# Altium project UL-SWAP-DAQ-1.PrjPcb (part 2 of 2)

## Sheet ICD4_Interface_Module.SchDoc
size A; SheetNumber: 4; SheetTotal: 16
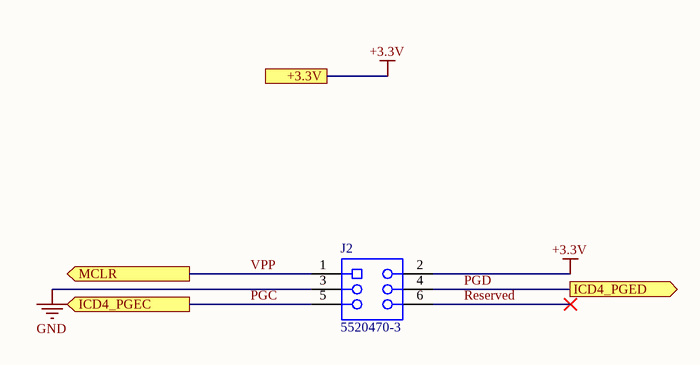
[diagram p10: ICD4_Interface_Module.SchDoc]

### Parts
J2  5520470-3  [TECO-5520470-3_V]

### Ports
+3.3V, ICD4_PGEC (out), ICD4_PGED (out), MCLR (out)

### Nets
+3.3V: J2.2 ; port +3.3V
GND: J2.3
PGC: J2.5 ; port ICD4_PGEC
PGD: J2.4 ; port ICD4_PGED
Reserved: J2.6
VPP: J2.1 ; port MCLR  [project net MCLR]

### Library data of the parts
J2 = CMP-1682-00001-5: Modular Jack, 6 Position, Right Angle, RoHS, Tray; Manufacturer: TE Connectivity; Voltage Rating: 150 V; Current Rating: 1.5 A; Lead Pitch: 2.54 mm; Contact Material: Bronze; RoHSCompliant: true; Contact Finish: Gold; REACH SVHC: Unknown; Height: 16.13 mm; Colour: Black; ComponentLink1Description: Manufacturer URL; PackageDescription: Female Header, Pitch 1.27 mm, 2 x 3 Position, Height 16.13 mm, Tail Length 4.32 mm; ComponentLink2URL: http://www.te.com/commerce/DocumentDelivery/DDEController?Action=srchrtrv&DocNm=5520470&DocType=Customer+Drawing&DocLang=English; ComponentLink2Description: Datasheet; Package Quantity: 176; Pins: 6; Length: 13.34 mm; Packaging: Tray; Contact Plating: Gold; Housing Material: PBT; Max Voltage Rating (AC): 150 V; ComponentLink1URL: http://www.te.com/; Mount: Through Hole; DatasheetVersion: Rev. B1, 03/2011; PackageReference: 5520470-3; Mounting Technology: Through Hole

## Sheet 403mainschematic.SchDoc
size A; SheetNumber: 7; SheetTotal: 15
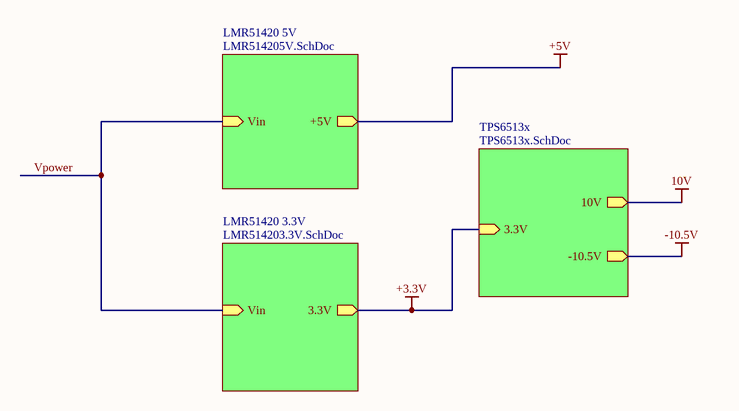
[diagram p11: 403mainschematic.SchDoc]

### Sub-sheets
LMR51420 3.3V = LMR514203.3V.SchDoc (file not in this document): Vin (in), 3.3V (out)
LMR51420 5V = LMR514205V.SchDoc: Vin (in), +5V (out)
TPS6513x = TPS6513x.SchDoc: 3.3V (in), 10V (out), -10.5V (out)

### Nets
10V: sheet TPS6513x/10V
+3.3V: sheet LMR51420 3.3V/3.3V, sheet TPS6513x/3.3V
Vpower: sheet LMR51420 3.3V/Vin, sheet LMR51420 5V/Vin  [project net Vin]

## Sheet LMR514205V.SchDoc
size A; SheetNumber: 8; SheetTotal: 15
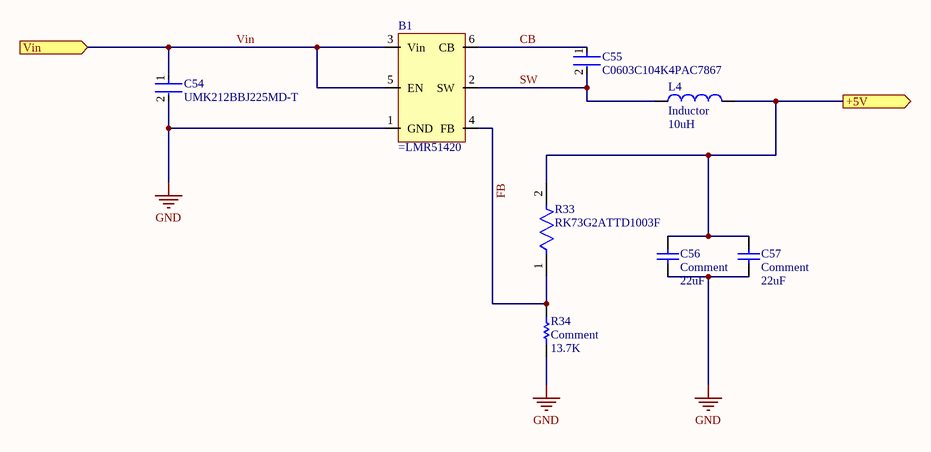
[diagram p12: LMR514205V.SchDoc]

### Parts
(Parts that share a designator on the sheet are numbered #1, #2 ... from top to bottom, then left to right.)
B1#2  (no value)  [PCBComponent_1]
C54  UMK212BBJ225MD-T  [FP-0805-L_2_0_0_2-W_1_25-IPC_A]
C55#1  C0603C104K4PAC7867  [FP-C0603C-CF-MFG]
C56#1  Comment  value 22uF  [Cap22uF_C1206C226M4PAC7800]
C57#1  Comment  value 22uF  [Cap22uF_C1206C226M4PAC7800]
L4  Inductor  value 10uH  [0402-A]
R33  RK73G2ATTD1003F  [FP-RK73G2A-IPC_A]
R34  Comment  value 13.7K  [RMCF0805FT13K7_13.7k]

### Ports
+5V (out), Vin (in)

### Nets
+5V: C56#1.2 C57#1.2 L4.2 R33.2 ; port +5V
GND: B1#2.1(GND) C54.2 C56#1.1 C57#1.1 R34.1
CB: B1#2.6(CB) C55#1.1
FB: B1#2.4(FB) R33.1 R34.2
SW: B1#2.2(SW) C55#1.2 L4.1
Vin: B1#2.3(Vin) B1#2.5(EN) C54.1 ; port Vin

### Library data of the parts
B1#2 = Component_1
C54 = CMP-14477-004278-2: Multilayer Ceramic Capacitor 2.2uF 50V X5R 20% SMD 0803 T/R; Max Operating Temperature: 85°C; Tolerance: 20%; Case Code (Imperial): 0805; Case/Package: 0805; Case Code (Metric): 2012; Capacitance: 2.2uF; Min Operating Temperature: -55°C; Mount: Surface Mount; Voltage Rating: 50V; Packaging: Tape and Reel; RoHS Compliant: Yes
C55#1 = CMP-03020-002384-2: CAP CER 0.1UF 16V X5R 0603; Manufacturer: KEMET; Automotive Grade: Grade 1; Value: 0.10 μF; Material: Ceramic; Temperature Coefficient: 30ppm/°C; Tolerance: 0.1; Manufacturer Part Number: C0603C104K4PAC7867; Automotive: Yes; Octopart: https://octopart.com/c0603c104k4pactu-kemet-12592163; Device Class L2: Capacitors; ComponentLink2URL: https://api.kemet.com/component-edge/download/datasheet/C0603C100J5GACAUTO.pdf; RoHS: TRUE; Height: 0.87mm; Temperature Characteristic: X5R; Voltage Rating: 16 V; Device Class L1: Passive Components; Category: Cap; Digikey Description: CAP CER 0.1UF 16V X5R 0603; Temperature Range High: +125°C; Package: C0603C-CF; Device Class L3: Ceramic Capacitors; Lead Free: Yes; Temperature: -55°C to +125°C; Temperature Range Low: -55°C; Capacitance: 0.10 μF; ComponentLink2Description: Datasheet
C56#1 C57#1 = Cap: Capacitor; Published: 8-Jun-2000; LatestRevisionDate: 17-Jul-2002; LatestRevisionNote: Re-released for DXP Platform.; PackageReference: RAD-0.3; Publisher: Altium Limited; PackageDescription: Radial Cap, Thru-Hole; 2 Leads; 0.3 in Pin Spacing
L4 = Inductor: Code_IEC: 1005; Published: 8-Jun-2000; LatestRevisionDate: 29-May-2009; LatestRevisionNote: IPC-7351 Footprint Added.; PackageReference: 0402-A; Publisher: Altium Limited; PackageDescription: Chip Inductor; Code_JEITA: 0402
R33 = CMP-04015-080178-1: 100kΩ ±1% 0.125W Chip Resistor 0805 Thick Film AEC-Q200 Qualified; Voltage Rating: 150V; Power Rating: 125mW; Temperature Coefficient: 50ppm/°C; Resistance: 100kR; Series: RK73G; Termination: SMD/SMT; Packaging: Tape and Reel; Tolerance: 1%; Case Code (Imperial): 0805; RoHS Compliant: Yes; Max Operating Temperature: 125°C; Min Operating Temperature: -55°C; Case Code (Metric): 2012
R34 = Res1: Resistor; Published: 8-Jun-2000; LatestRevisionDate: 17-Jul-2002; LatestRevisionNote: Re-released for DXP Platform.; PackageReference: AXIAL-0.3; Publisher: Altium Limited; PackageDescription: Axial Device, Thru-Hole; 2 Leads; 0.3 in Pin Spacing

## Sheet TPS6513x.SchDoc
size A; SheetNumber: 9; SheetTotal: 15
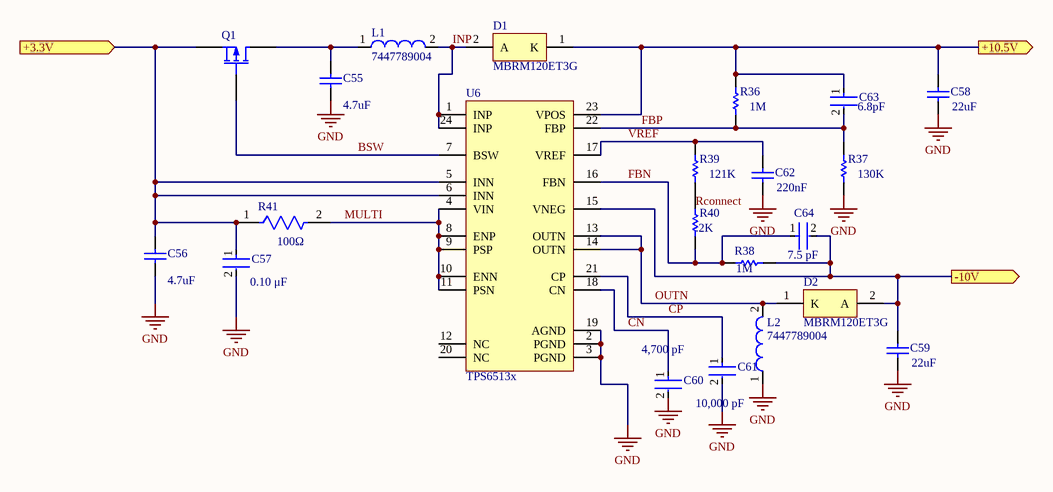
[diagram p13: TPS6513x.SchDoc]

### Parts
(Parts that share a designator on the sheet are numbered #1, #2 ... from top to bottom, then left to right.)
C55#2  value 4.7uF  [4.7uF_C1206C475K3RACAUTO]  (hidden comment: Comment)
C56#2  value 4.7uF  [4.7uF_C1206C475K3RACAUTO]  (hidden comment: Comment)
C57#2  value 0.10 μF  [FP-C0402-BB-MFG]  (hidden comment: C0402C104K8PAC)
C58  value 22uF  [Cap22uF_C1206C226M4PAC7800]  (hidden comment: Comment)
C59  value 22uF  [Cap22uF_C1206C226M4PAC7800]  (hidden comment: Comment)
C60  Capacitance: 4,700 pF  [FP-C1206C-EB-MFG]  (hidden comment: C1206C472J5GAC)
C61  value 10,000 pF  [FP-C0402-BB-MFG]  (hidden comment: C0402C103J4RAC)
C62  value 220nF  [PCBComponent_1]  (hidden comment: Comment)
C63  Capacitance: 6.8pF  [FP-CGA1A-0_1-0_03-IPC_B]  (hidden comment: CGA1A2C0G1E6R8D030BA)
C64  value 7.5 pF  [FP-C0805C-DN-MFG]  (hidden comment: C0805C759D5GACTU)
D1  MBRM120ET3G  [ONSC-POWERMITE-2-457-04_D_V]
D2  MBRM120ET3G  [ONSC-POWERMITE-2-457-04_D_V]
L1  7447789004  [WE-PD-S-PB]
L2  7447789004  [WE-PD-S-PB]
Q1  Comment  [PCBComponent_1]  (value not drawn)
R36  value 1M  [1Mohm_ESR01MZPF1004]  (hidden comment: ESR01MZPF1004)
R37  value 130K  [130k_RGV3216P-1303-B-T1]  (hidden comment: SFR03EZPF1303)
R38  value 1M  [1Mohm_ESR01MZPF1004]  (hidden comment: Comment)
R39  value 121K  [121k_RE0201BRE07121KL]  (hidden comment: Comment)
R40  value .2K  [200ohm_ESR01MZPF2000]  (hidden comment: Comment)
R41  Resistance: 100Ω  [FP-AC0603-IPC_A]  (hidden comment: AC0603FR-10100RL)
U6#2  TPS6513x  [RGE0024B_V]

### Ports
+3.3V (in), +10.5V (out), -10V (out)

### Nets
GND: C55#2.2 C56#2.2 C57#2.2 C58.1 C59.1 C60.2 C61.2 C62.1 L2.1 R37.1 U6#2.2(PGND) U6#2.3(PGND) U6#2.19(AGND)
BSW: Q1.2(G) U6#2.7(BSW)
CN: C60.1 U6#2.18(CN)
CP: C61.1 U6#2.21(CP)
FBN: C64.1 R38.2 R40.1 U6#2.16(FBN)
FBP: C63.2 R36.1 R37.2 U6#2.22(FBP)
INP: D1.2(A) L1.2 U6#2.1(INP) U6#2.24(INP)
MULTI: R41.2 U6#2.4(VIN) U6#2.8(ENP) U6#2.9(PSP) U6#2.10(ENN) U6#2.11(PSN)
OUTN: D2.1(K) L2.2 U6#2.13(OUTN) U6#2.14(OUTN)
VREF: C62.2 R39.2 U6#2.17(VREF)
NetC55#2_1: C55#2.1 L1.1 Q1.1(D)
NetC56#2_1: C56#2.1 C57#2.1 Q1.3(S) R41.1 U6#2.5(INN) U6#2.6(INN) ; port +3.3V
NetC58_2: C58.2 C63.1 D1.1(K) R36.2 U6#2.23(VPOS) ; port +10.5V
NetC59_2: C59.2 C64.2 D2.2(A) R38.1 U6#2.15(VNEG) ; port -10V
NetR39_1: R39.1 R40.2

Not connected (* = marked no-connect by the designer): U6#2 12(NC) 20(NC)

### Notes on the sheet
- Labels drawn without touching a wire or pin: Rconnect

### Library data of the parts
C55#2 C56#2 C58 C59 C62 = Cap: Capacitor; Published: 8-Jun-2000; LatestRevisionDate: 17-Jul-2002; LatestRevisionNote: Re-released for DXP Platform.; PackageReference: RAD-0.3; Publisher: Altium Limited; PackageDescription: Radial Cap, Thru-Hole; 2 Leads; 0.3 in Pin Spacing
C57#2 = CMP-03020-000918-1: C0402 0.10 μF X5R 10.00% 10 V; Manufacturer: Kemet; Voltage Rating: 10 V; Temperature Coefficient: 15%; Material: Ceramic; Tolerance: 0.1; Device Class L1: Passive Components; ComponentLink2URL: https://content.kemet.com/datasheets/KEM_C1002_X7R_SMD.pdf; Manufacturer Part Number: C0402C104K8PAC; RoHS: TRUE; Capacitance: 0.10 μF; Category: Cap; Lead Free: Yes; Octopart: https://octopart.com/c0402c104k8pac-kemet-2645080; Mouser Description: Cap-fxd 0.1UF +-10PCT 10V Cer X5R 0402 S; Device Class L2: Capacitors; Ipc Land Pattern Name: CAPC10050X50; Temperature Characteristic: X5R; Device Class L3: Ceramic Capacitors; Temperature Range High: +125°C; Package: C0402-BB; Temperature Range Low: -55°C; Automotive: No; Height: 0.55mm; ComponentLink2Description: Datasheet; Temperature: -55°C to +125°C
C60 = CMP-03020-017963-1: C1206 4,700 pF C0G 5.00% 50 V; Manufacturer: KEMET; Material: Ceramic; Automotive Grade: Grade 0; Voltage Rating: 50 V; Temperature Coefficient: 15%; Tolerance: 0.05; Ipc Land Pattern Name: CAPC320160X78; Temperature Range Low: -55°C; Temperature: -55°C to +150°C; Octopart: https://octopart.com/c1206c472j5gac-kemet-1350327; ComponentLink2Description: Datasheet; Height: 0.88mm; Device Class L2: Capacitors; Package: C1206C-EB; Device Class L3: Ceramic Capacitors; Automotive: Yes; Temperature Range High: +150°C; Temperature Characteristic: C0G; Category: Cap; Manufacturer Part Number: C1206C472J5GAC; Lead Free: Yes; Mouser Description: Multilayer Ceramic Capacitors MLCC - SMD/SMT 50volts 4700pF 5% C0G; Value: 4,700 pF; RoHS: TRUE; Device Class L1: Passive Components; ComponentLink2URL: https://content.kemet.com/datasheets/KEM_C1007_X8R_ULTRA_150C_SMD.pdf
C61 = CMP-03020-009089-1: C0402 10,000 pF X7R 5.00% 16 V; Manufacturer: Kemet; Tolerance: 0.05; Material: Ceramic; Voltage Rating: 16 V; Temperature Coefficient: 15%; Category: Cap; Manufacturer Part Number: C0402C103J4RAC; ComponentLink2URL: https://content.kemet.com/datasheets/KEM_C1002_X7R_SMD.pdf; Octopart: https://octopart.com/c0402c103j4rac-kemet-8293494; Temperature Range High: +125°C; Temperature: -55°C to +125°C; RoHS: TRUE; Device Class L1: Passive Components; Lead Free: Yes; Temperature Range Low: -55°C; Ipc Land Pattern Name: CAPC10050X50; Package: C0402-BB; Mouser Description: Multilayer Ceramic Capacitors MLCC - SMD/SMT 16volts 0.01uF 5% X7R; Temperature Characteristic: X7R; Device Class L3: Ceramic Capacitors; Height: 0.55mm; Device Class L2: Capacitors; ComponentLink2Description: Datasheet; Capacitance: 10,000 pF; Automotive: No
C63 = CMP-08246-001552-1: Cap Ceramic 6.8pF 25V C0G 0.5pF Pad SMD 0201 125°C Automotive T/R; Min Operating Temperature: -55°C; Packaging: Tape and Reel; Mount: Surface Mount; Length: 0.6mm; Dielectric: C0G; Depth: 0.3mm; Ratings: AEC-Q200; Case Code (Metric): 0603; Height: 0.3mm; Weight: 6E-06oz; Case Code (Imperial): 0201; Case/Package: 0201; Thickness: 0.013inch; Voltage Rating: 25V; Package Quantity: 1; Voltage Rating (DC): 25V; Composition: Ceramic; Max Operating Temperature: 125°C; Width: 0.012inch; Termination: SMD/SMT
C64 = CMP-1036-00734-2: CAP CER 7.5PF 50V NP0 0805; Manufacturer: KEMET; Temperature Characteristic: C0G; Tolerance: 0.5 pF; Material: Ceramic; Temperature Coefficient: 30ppm/°C; Package: C0805C-DN; Ipc Land Pattern Name: CAPC200125X78; Category: Cap; Height: 0.88mm; ComponentLink2URL: https://content.kemet.com/datasheets/KEM_C1003_C0G_SMD.pdf; Temperature: -55°C to +125°C; Device Class L3: Ceramic Capacitors; Mouser Description: Multilayer Ceramic Capacitors MLCC - SMD/SMT 50volts 7.5pF C0G 0.5%; Capacitance: 7.5 pF; Manufacturer Part Number: C0805C759D5GACTU; Lead Free: Yes; Octopart: https://octopart.com/c0805c759d5gactu-kemet-17134963; Temperature Range Low: -55°C; ComponentLink2Description: Datasheet; Voltage Rating: 50 V; Temperature Range High: +125°C; Device Class L2: Capacitors; RoHS: TRUE; Device Class L1: Passive Components; Automotive: No; Digikey Description: CAP CER 7.5PF 50V NP0 0805
D1 D2 = CMP-1055-00280-1: Schottky Power Rectifier, 2-Pin Powermite, Pb-Free, Tape and Reel; Manufacturer: On Semiconductor; Configuration: Single; IFSM Max (A): 50; Packing: Tape and Reel; ComponentLink1URL: http://www.onsemi.com/; PartNumber: MBRM120ET3G; Mounting Technology: Surface Mount; PackageReference: POWERMITE-2-457-04; DatasheetVersion: Rev. 3; ComponentLink2URL: http://www.onsemi.cn/pub_link/Collateral/MBRM120E-D.PDF; ComponentLink2Description: Datasheet; PackageVersion: Rev. F, 05/2013; ComponentLink3URL: http://www.onsemi.com/pub_link/Collateral/457-04.PDF; RoHS: TRUE; PackageDescription: 2-Pin POWERMITE, Body 1.965 x 1.9 mm; ComponentLink3Description: Package Specification; ComponentLink1Description: Manufacturer URL
L1 L2 = CMP-1396-00050-1: SMD-Shielded Power Inductor WE-PD, L=4.70 µH; Manufacturer: Wuerth Elektronik; Inductance: 4.70 ÂµH; ComponentLink2URL: http://www.we-online.de/katalog/media/pdf/7447789004.pdf; ComponentLink2Description: Datasheet; PackageDescription: SMD Inductor, 2-Leads, Body 7.3 x 7.3 mm; ComponentLink1Description: Manufacturer URL; PackageReference: WE-PD-S-PB; ComponentLink1URL: http://www.we-online.com; PartNumber: 7447789004
Q1 = MOSFET-P: P-Channel MOSFET; Published: 8-Jun-2000; LatestRevisionDate: 17-Jul-2002; LatestRevisionNote: Re-released for DXP Platform.; PackageVersion: 1995/1996; PackageReference: E3; Publisher: Altium Limited; PackageDescription: TO, Flat Index; 3 In-Line, Axial Leads; Body Dia. 4.6mm; Lead Dia. 0.5 mm (max)
R36-R40 = Res1: Resistor; Published: 8-Jun-2000; LatestRevisionDate: 17-Jul-2002; LatestRevisionNote: Re-released for DXP Platform.; PackageReference: AXIAL-0.3; Publisher: Altium Limited; PackageDescription: Axial Device, Thru-Hole; 2 Leads; 0.3 in Pin Spacing
R41 = CMP-03412-011629-2: RES 100Ω 1.00% 0.1W 0603; Tolerance: 1%; RoHS Compliant: Yes; Case/Package: 0603
U6#2 = CMP-0347-00005-4: Boost Inverting Buck-Boost Voltage Converter with 2.7 to 5.5 V Input and -15 to 15 V Output, -40 to 85 degC, 24-Pin VQFN (RGE), Green (RoHS & no Sb/Br); PartNumber: TPS65130RGER; Manufacturer: Texas Instruments; Vout2(V): -15 to -2; Regulated Outputs(#): 2; Switching Frequency(Typ)(kHz): 1400; Vout(Max)(V): 15; Vin(Min)(V): 2.7; SubFamily: Step-Up Regulator; Vin(Max)(V): 5.5; Topology: Boost, Inverting Buck-Boost; ComponentLink2URL: http://www.ti.com/litv/pdf/mpqf124f; ComponentLink2Description: Package Specification; DatasheetVersion: SLVS493B; ComponentLink1Description: Datasheet; Code_JEDEC: MO-220; PackageVersion: revG, Jul-2011; ComponentLink1URL: http://www.ti.com/general/docs/lit/getliterature.tsp?genericPartNumber=TPS65130&fileType=pdf; Eco-Plan: Green (RoHS & no Sb/Br); PackageDescription: 24-Pin Plastic Quad Flatpack No-Lead, 4 x 4 mm Body, 0.5 mm Pitch; PackageReference: RGE0024B; Vout(Min)(V): -15; Mounting Technology: Surface Mount

## Nets that join several sheets
+3.3V: ADC_Subsystem (C11.2 U2.25), PIC32_Subsystem (12 pins), LVDS_Driver_Subsystem (U3.1), ICD4_Interface_Module (J2.2)
+5V: THS7002CPWP_Schematic (C28.1 U4.20), LTC6362_Schematic (U6#1.3 U7.3), THS7002CPWP_Schematic_2 (C19#1.1 U5.20), LTC6362_Schematic_2 (AmpC.3 AmpD.3), ADC_Subsystem (C13.2 U2.29), LMR514205V (C56#1.2 C57#1.2 L4.2 R33.2)
+10V: THS7002CPWP_Schematic (5 pins), THS7002CPWP_Schematic_2 (5 pins)
-10.5V: THS7002CPWP_Schematic (5 pins), THS7002CPWP_Schematic_2 (5 pins)
GND: THS7002CPWP_Schematic (14 pins), LTC6362_Schematic (10 pins), THS7002CPWP_Schematic_2 (14 pins), LTC6362_Schematic_2 (10 pins), ADC_Subsystem (14 pins), PIC32_Subsystem (14 pins), LVDS_Driver_Subsystem (U3.4), ICD4_Interface_Module (J2.3), LMR514205V (5 pins), TPS6513x (13 pins)
A_GP0: THS7002CPWP_Schematic (U4.28), PIC32_Subsystem (U1.42)
A_GP1: THS7002CPWP_Schematic (U4.27), PIC32_Subsystem (U1.43)
A_GP2: THS7002CPWP_Schematic (U4.26), PIC32_Subsystem (U1.44)
ADCSDI_PIC32SDO: ADC_Subsystem (U2.20), PIC32_Subsystem (U1.52)
ADCSDO_PIC32SDI: ADC_Subsystem (U2.22), PIC32_Subsystem (U1.47)
B_GP0: THS7002CPWP_Schematic (U4.15), PIC32_Subsystem (U1.62)
B_GP1: THS7002CPWP_Schematic (U4.16), PIC32_Subsystem (U1.61)
B_GP2: THS7002CPWP_Schematic (U4.17), PIC32_Subsystem (U1.60)
C_GP0: THS7002CPWP_Schematic_2 (U5.28), PIC32_Subsystem (U1.64)
C_GP1: THS7002CPWP_Schematic_2 (U5.27), PIC32_Subsystem (U1.1)
C_GP2: THS7002CPWP_Schematic_2 (U5.26), PIC32_Subsystem (U1.2)
D_GP0: THS7002CPWP_Schematic_2 (U5.15), PIC32_Subsystem (U1.5)
D_GP1: THS7002CPWP_Schematic_2 (U5.16), PIC32_Subsystem (U1.4)
D_GP2: THS7002CPWP_Schematic_2 (U5.17), PIC32_Subsystem (U1.3)
MCLR: PIC32_Subsystem (MCLR.2 R3.1 U1.7), ICD4_Interface_Module (J2.1)
NetU1_46: ADC_Subsystem (U2.24), PIC32_Subsystem (U1.46)
NetU1_53: ADC_Subsystem (U2.19), PIC32_Subsystem (U1.53)
NetU1_54: ADC_Subsystem (U2.18), PIC32_Subsystem (U1.54)
NetU1_55: ADC_Subsystem (U2.16), PIC32_Subsystem (U1.55)
PGA_A_Out: THS7002CPWP_Schematic (U4.24), LTC6362_Schematic (R26.1)
PGA_B_Out: THS7002CPWP_Schematic (U4.19), LTC6362_Schematic (R20.1)
PGA_C_Out: THS7002CPWP_Schematic_2 (U5.24), LTC6362_Schematic_2 (R6#2.1)
PGA_D_Out: THS7002CPWP_Schematic_2 (U5.19), LTC6362_Schematic_2 (R5#2.1)
PGC: PIC32_Subsystem (U1.17), ICD4_Interface_Module (J2.5)
PGD: PIC32_Subsystem (U1.18), ICD4_Interface_Module (J2.4)
SCK: ADC_Subsystem (U2.21), PIC32_Subsystem (U1.50)
Sensor_A_N: Capstone_Signal_Conditioners_Subsystem_Test_Schematic (B1#1.1), THS7002CPWP_Schematic (U4.5)
Sensor_A_P: Capstone_Signal_Conditioners_Subsystem_Test_Schematic (B1#1.2), THS7002CPWP_Schematic (U4.6)
Sensor_B_N: Capstone_Signal_Conditioners_Subsystem_Test_Schematic (B1#1.4), THS7002CPWP_Schematic (U4.10)
Sensor_B_P: Capstone_Signal_Conditioners_Subsystem_Test_Schematic (B1#1.3), THS7002CPWP_Schematic (U4.9)
Sensor_C_N: Capstone_Signal_Conditioners_Subsystem_Test_Schematic (B1#1.6), THS7002CPWP_Schematic_2 (U5.5)
Sensor_C_P: Capstone_Signal_Conditioners_Subsystem_Test_Schematic (B1#1.7), THS7002CPWP_Schematic_2 (U5.6)
Sensor_D_N: Capstone_Signal_Conditioners_Subsystem_Test_Schematic (B1#1.9), THS7002CPWP_Schematic_2 (U5.10)
Sensor_D_P: Capstone_Signal_Conditioners_Subsystem_Test_Schematic (B1#1.8), THS7002CPWP_Schematic_2 (U5.9)
SHDN-A: THS7002CPWP_Schematic (U4.25), LTC6362_Schematic (U6#1.7), PIC32_Subsystem (U1.45)
SHDN-B: THS7002CPWP_Schematic (U4.18), LTC6362_Schematic (U7.7), PIC32_Subsystem (U1.59)
SHDN-C: THS7002CPWP_Schematic_2 (U5.25), LTC6362_Schematic_2 (AmpC.7), PIC32_Subsystem (U1.63)
SHDN-D: THS7002CPWP_Schematic_2 (U5.18), LTC6362_Schematic_2 (AmpD.7), PIC32_Subsystem (U1.6)
UART_TX: PIC32_Subsystem (U1.32), LVDS_Driver_Subsystem (U3.2)